# Altium schematic sheet Sheet1.SchDoc
size 431 x 279 mm; ENG_APP_DATE: --/--/--; DSN_APP_DATE: --/--/--; CHK_APP_DATE: --/--/--
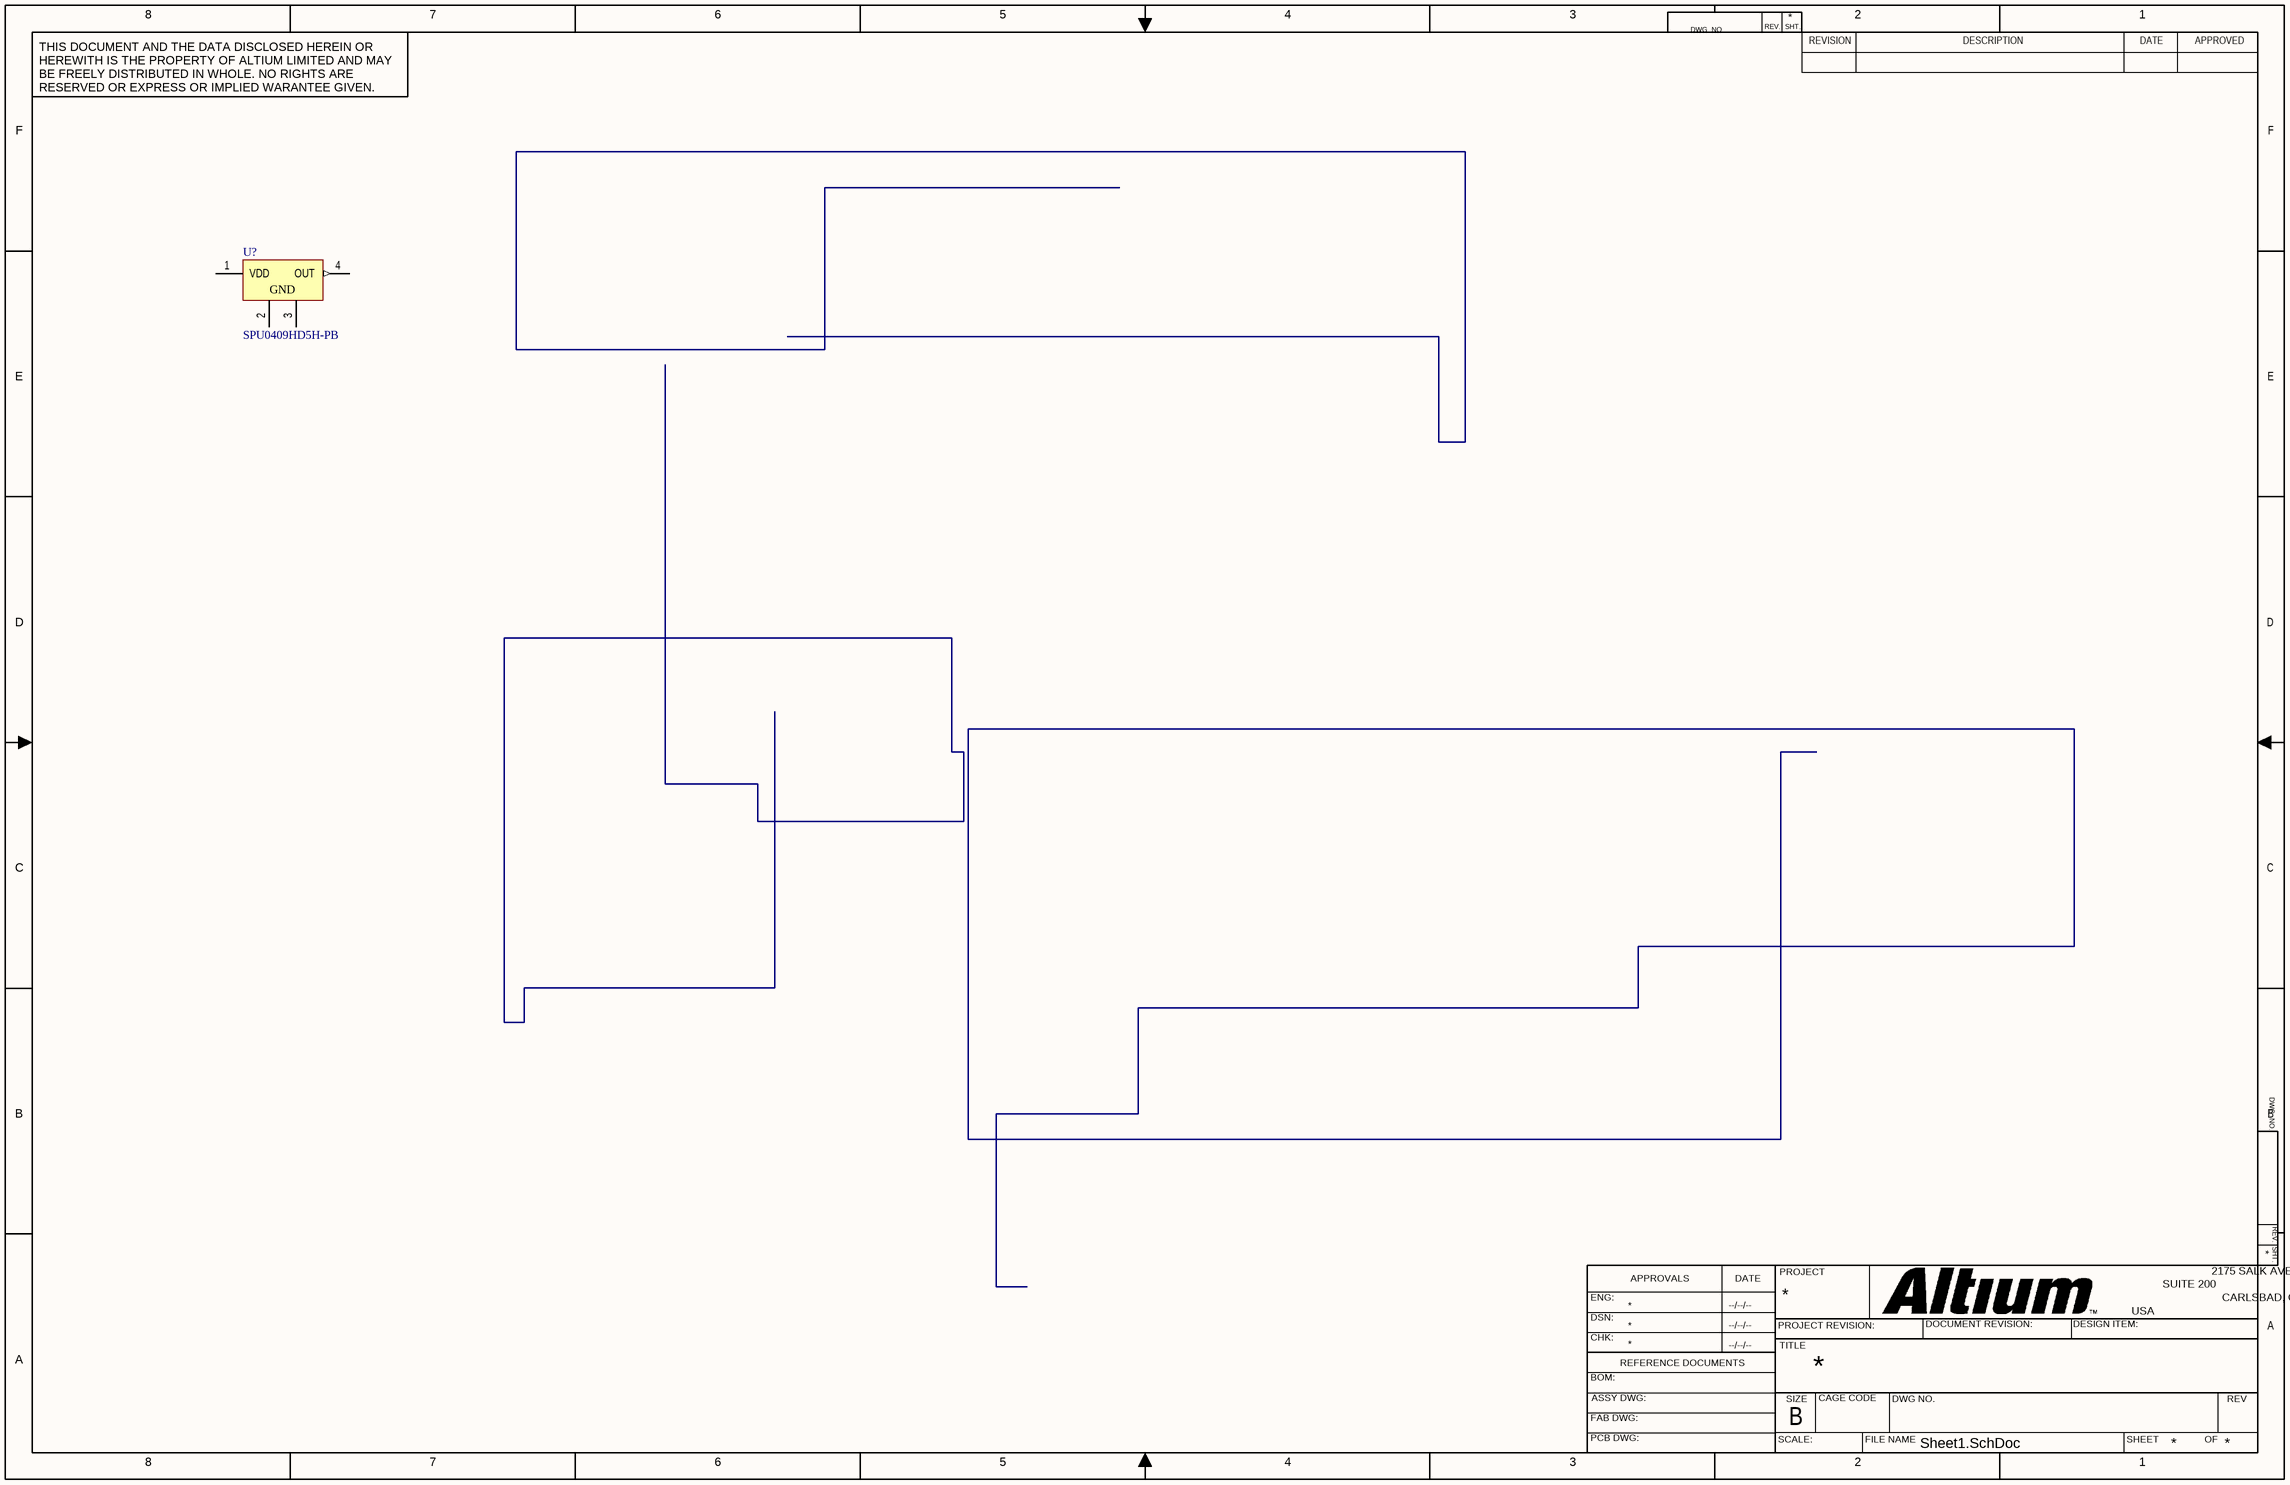
[diagram p0: Sheet1.SchDoc]

## Parts
U?  SPU0409HD5H-PB  [KNOW-SPU0409HD5H-PB_V]

## Nets

Not connected (* = marked no-connect by the designer): U? 1(VDD) 2(GROUND) 3(GROUND) 4(OUT)

## Notes on the sheet
- 8
- 7
- 6
- 5
- 4
- 3
- DWG. NO.
- REV.
- SHT.
- 2
- 1
- THIS DOCUMENT AND THE DATA DISCLOSED HEREIN OR HEREWITH IS THE PROPERTY OF ALTIUM LIMITED AND MAY BE FREELY DISTRIBUTED IN WHOLE. NO RIGHTS ARE RESERVED OR EXPRESS OR IMPLIED WARANTEE GIVEN.
- REVISION
- DESCRIPTION
- DATE
- APPROVED
- F
- E
- D
- C
- B
- ENG:
- APPROVALS
- PROJECT
- SUITE 200
- 2175 SALK AVENUE
- CARLSBAD, CA 92008
- A
- DSN:
- CHK:
- REFERENCE DOCUMENTS
- PROJECT REVISION:
- TITLE
- DOCUMENT REVISION:
- DESIGN ITEM:
- USA
- BOM:
- FAB DWG:
- PCB DWG:
- ASSY DWG:
- SCALE:
- SIZE
- CAGE CODE
- FILE NAME
- DWG NO.
- SHEET
- OF
- REV
- (in symbol CMP-00027-00001-1) GND

## Library data of the parts
U? = CMP-00027-00001-1: SiSonic(TM) Microphone, 1.5 to 3.6 V, -40 to 100 degC, 4-Pin SMD, RoHS, Tape and Reel; Manufacturer: Knowles Acoustics; Voltage Rating: 3.6V; Impedance: 100Ohm; Package Quantity: 1200; RoHS Compliant: True; Manufacturer URL: http://www.knowles.com/; Datasheet URL: http://datasheet.octopart.com/SPU0409HD5H-PB-Knowles-Acoustics-datasheet-17019172.pdf; Package Reference: SPU0409HD5H-PB; Case/Package: SPU0409HD5H-PB; Mounting Technology: SM; Packaging: TapeandReel; Package Description: 4-Pin Surface Mount Device, Body 3.76 x 2.95 mm; Datasheet Version: Rev. F, 03/2013